# Altium schematic sheet connectors.SchDoc
size A4; SheetNumber: 3; SheetTotal: 3
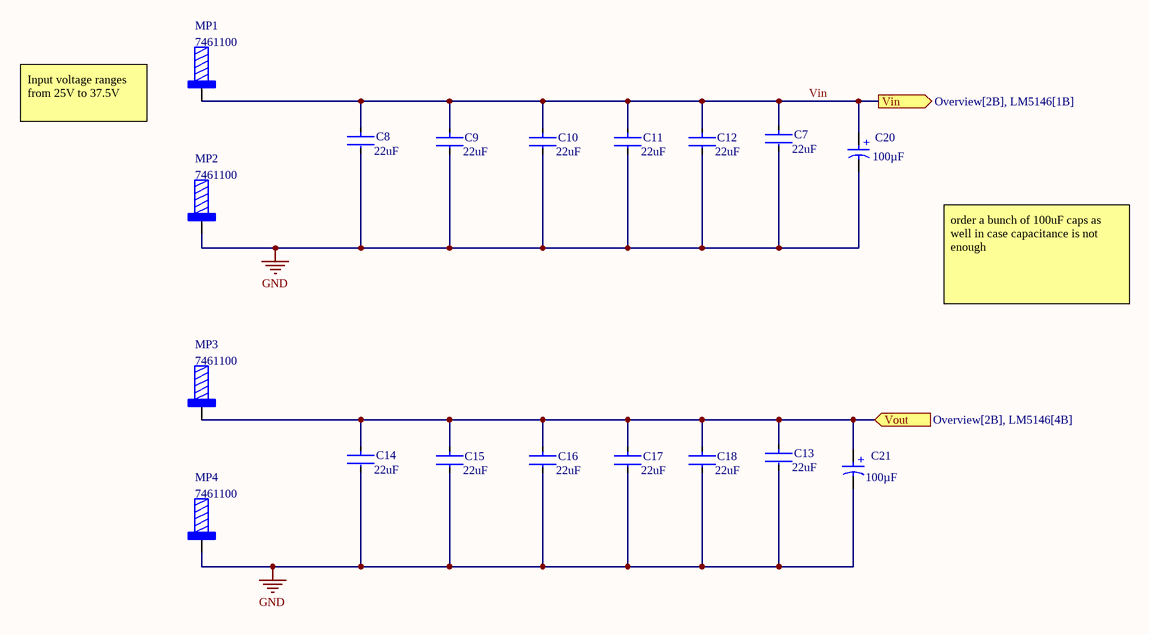
[diagram p0: connectors.SchDoc]

## Parts
C7  Capacitance: 22uF  [FP-C2220C226M5R2C7289-MFG]  (hidden comment: C2220C226M5R2C7289)
C8  Capacitance: 22uF  [FP-C2220C226M5R2C7289-MFG]  (hidden comment: C2220C226M5R2C7289)
C9  Capacitance: 22uF  [FP-C2220C226M5R2C7289-MFG]  (hidden comment: C2220C226M5R2C7289)
C10  Capacitance: 22uF  [FP-C2220C226M5R2C7289-MFG]  (hidden comment: C2220C226M5R2C7289)
C11  Capacitance: 22uF  [FP-C2220C226M5R2C7289-MFG]  (hidden comment: C2220C226M5R2C7289)
C12  Capacitance: 22uF  [FP-C2220C226M5R2C7289-MFG]  (hidden comment: C2220C226M5R2C7289)
C13  Capacitance: 22uF  [FP-C2220C226M5R2C7289-MFG]  (hidden comment: C2220C226M5R2C7289)
C14  Capacitance: 22uF  [FP-C2220C226M5R2C7289-MFG]  (hidden comment: C2220C226M5R2C7289)
C15  Capacitance: 22uF  [FP-C2220C226M5R2C7289-MFG]  (hidden comment: C2220C226M5R2C7289)
C16  Capacitance: 22uF  [FP-C2220C226M5R2C7289-MFG]  (hidden comment: C2220C226M5R2C7289)
C17  Capacitance: 22uF  [FP-C2220C226M5R2C7289-MFG]  (hidden comment: C2220C226M5R2C7289)
C18  Capacitance: 22uF  [FP-C2220C226M5R2C7289-MFG]  (hidden comment: C2220C226M5R2C7289)
C20  Capacitance: 100µF  [WCAP-ATUL_D8H11.5]  (hidden comment: 860040674004)
C21  Capacitance: 100µF  [WCAP-ATUL_D8H11.5]  (hidden comment: 860040674004)
MP1  7461100  [7461100_chemical surface]
MP2  7461100  [7461100_chemical surface]
MP3  7461100  [7461100_chemical surface]
MP4  7461100  [7461100_chemical surface]

## Ports
Vin (out, see Overview[2B], LM5146[1B]), Vout (in, see Overview[2B], LM5146[4B])

## Nets
GND: C7.2 C8.2 C9.2 C10.2 C11.2 C12.2 C13.2 C14.2 C15.2 C16.2 C17.2 C18.2 C20.2(N) C21.2(N) MP2.1 MP4.1
Vin: C7.1 C8.1 C9.1 C10.1 C11.1 C12.1 C20.1(P) MP1.1 ; port Vin
Vout: C13.1 C14.1 C15.1 C16.1 C17.1 C18.1 C21.1(P) MP3.1 ; port Vout

## Notes on the sheet
- Input voltage ranges from 25V to 37.5V
- order a bunch of 100uF caps as well in case capacitance is not enough
- (in symbol CMP-03913-53914310-2) +

## Library data of the parts
C7-C18 = CMP-03020-034691-1: CAP CER 22UF 50V X7R SMD; Tolerance: 20%; Dielectric Material: Ceramic; Length: 0.236inch; Max Operating Temperature: 125°C; Package Quantity: 1; Voltage Rating (DC): 50V; Case/Package: SMD/SMT; RoHS Compliant: Yes; Min Operating Temperature: -55°C; Width: 0.197inch; Mount: Surface Mount; Voltage Rating: 50V; Packaging: Tape and Reel; Thickness: 0.217inch
C20 C21 = CMP-03913-53914310-2: WCAP-ATUL Aluminum Electrolytic Capacitors; Ripple Current: 680mA; Tolerance: 20%; Leakage Current: 50µA; Pitch: 3.5mm; Voltage Rating (DC): 50V; Life (Hours): 7000hours; Polarity: Polar; Impedance: 160mΩ; RoHS: Compliant; Height - Seated (Max): 13.0048mm; Height: 11.5mm; Mount: Through Hole; REACH SVHC: Unknown; Min Operating Temperature: -40°C; Case/Package: Radial; Diameter: 8mm; Length: 11.5mm; Lead Pitch: 3.5052mm; Max Operating Temperature: 105°C; Voltage Rating: 50V; Packaging: Tape & Box (TB)
MP1-MP4 = CMP-03913-18187408-2: PCB power element shank terminal, 36P M10; Insulation: Non-Insulated; Number of Contacts: 36; Current Rating: 350A; Length: 16mm; Contact Plating: Tin; Width: 16mm; Contact Material: Copper; Max Operating Temperature: 150°C; Mount: Through Hole; Termination: Press-Fit; REACH SVHC: Unknown; RoHS: Compliant; Min Operating Temperature: -55°C; Number of Pins: 36; Thread Size: M10; Height: 24mm; Packaging: Bulk; Material: Brass